# EAGLE design Z80_Busses (EAGLE 5.10)
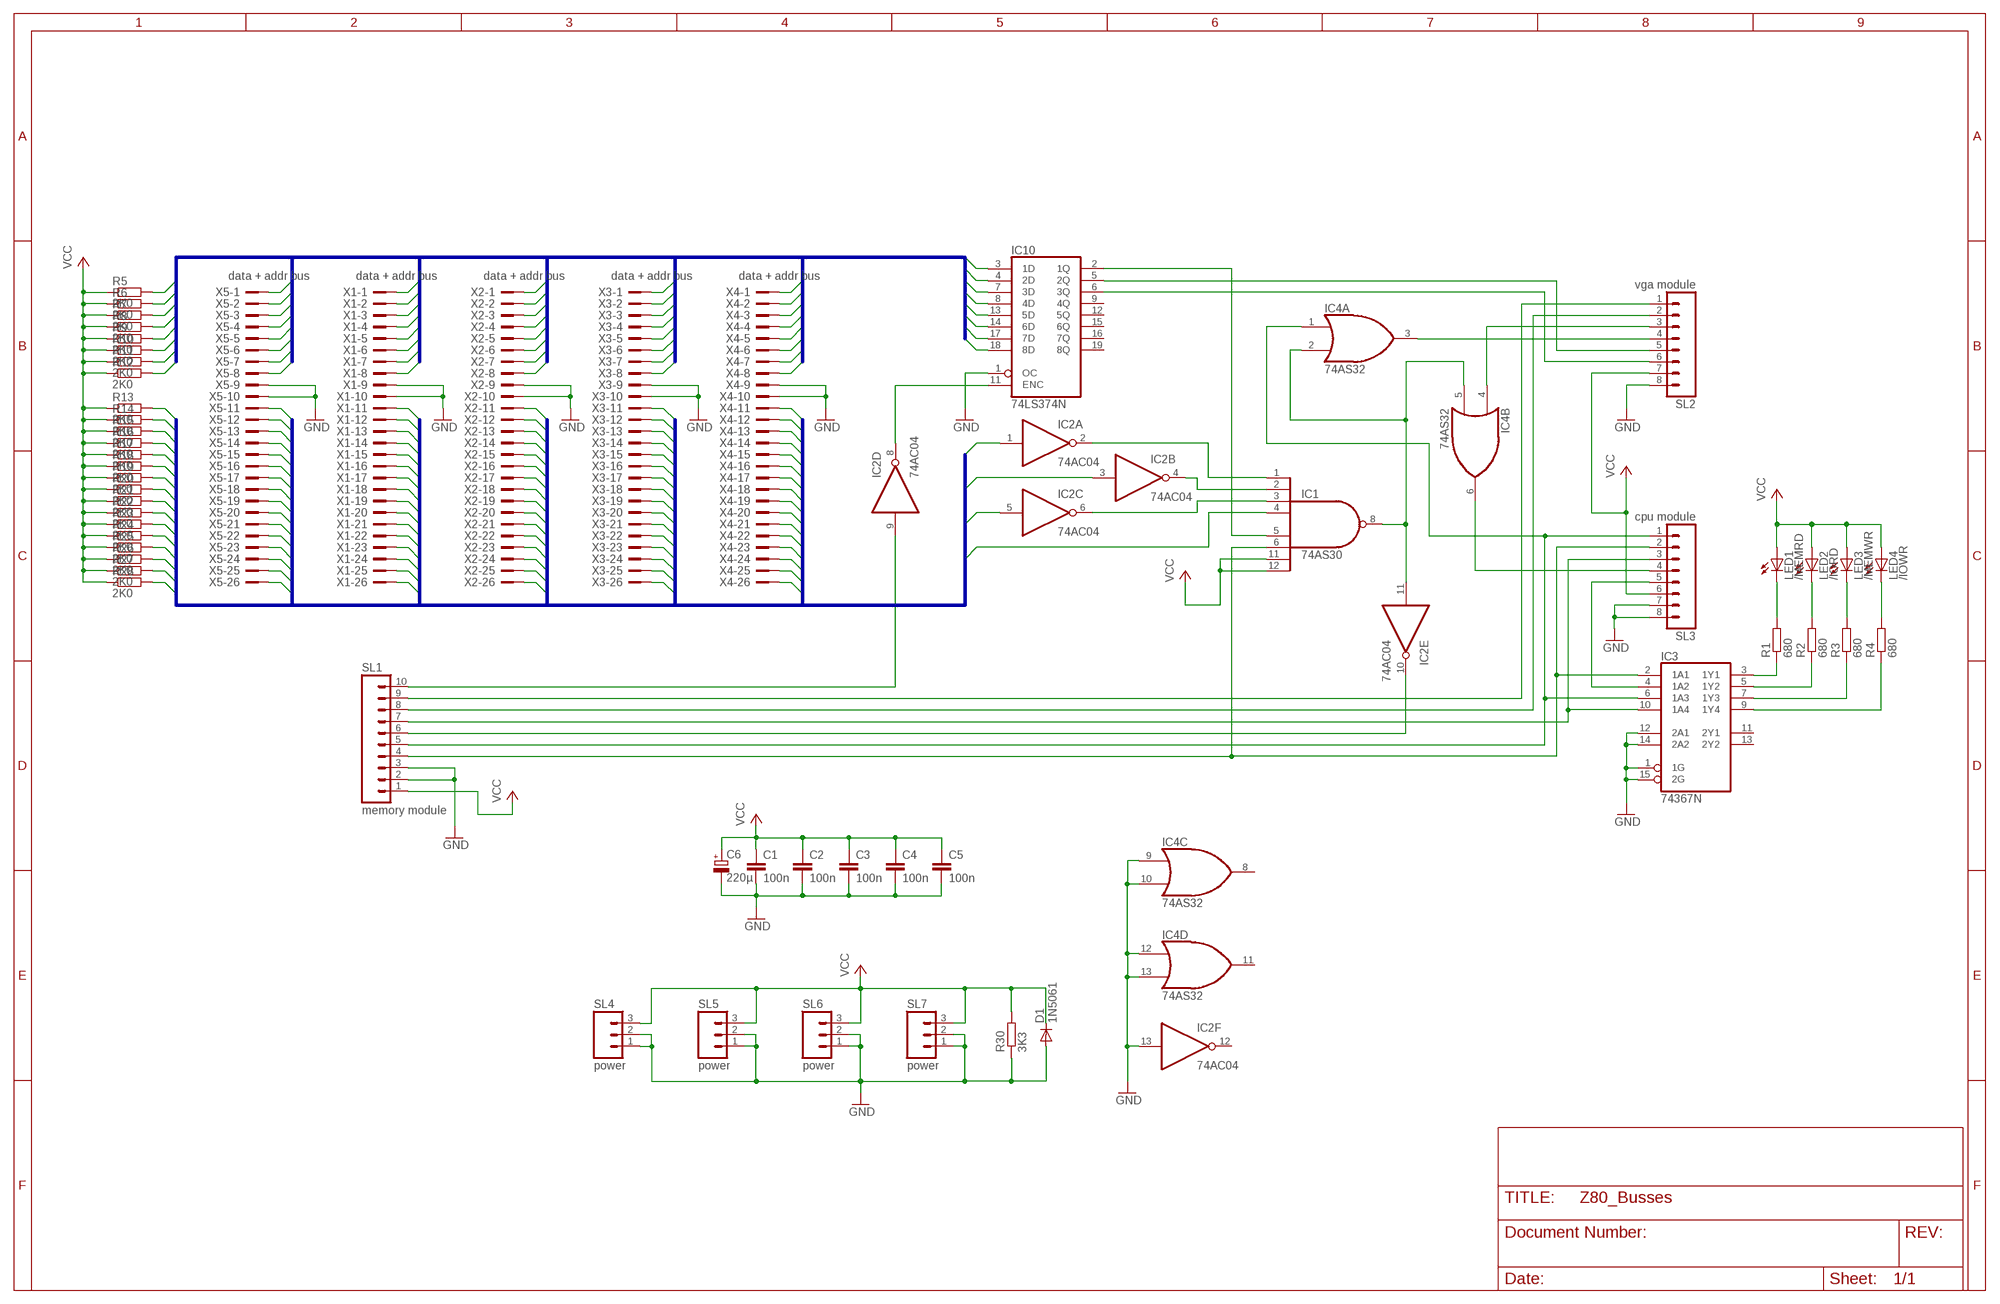
[diagram p0: schematic, sheet 1]

## Parts
C1  100n  C-EU050-030X075  [C050-030X075]
C2  100n  C-EU050-030X075  [C050-030X075]
C3  100n  C-EU050-030X075  [C050-030X075]
C4  100n  C-EU050-030X075  [C050-030X075]
C5  100n  C-EU050-030X075  [C050-030X075]
C6  220µ  CPOL-EUE3.5-10  [E3,5-10]
D1  1N5061  [SOD57-10]
IC1  74AS30  7430N  [DIL14]
IC2  74AC04  7404N  [DIL14]
IC3  74367N  [DIL16]
IC4  74AS32  7432N  [DIL14]
IC10  74LS374N  74LS373N  [DIL20]
LED1  /MEMRD  LED5MM  [LED5MM]
LED2  /IORD  LED5MM  [LED5MM]
LED3  /MEMWR  LED5MM  [LED5MM]
LED4  /IOWR  LED5MM  [LED5MM]
R1  680  R-EU_0207/10  [0207/10]
R2  680  R-EU_0207/10  [0207/10]
R3  680  R-EU_0207/10  [0207/10]
R4  680  R-EU_0207/10  [0207/10]
R5  2K0  R-EU_0204/2V  [0204V]
R6  2K0  R-EU_0204/2V  [0204V]
R7  2K0  R-EU_0204/2V  [0204V]
R8  2K0  R-EU_0204/2V  [0204V]
R9  2K0  R-EU_0204/2V  [0204V]
R10  2K0  R-EU_0204/2V  [0204V]
R11  2K0  R-EU_0204/2V  [0204V]
R12  2K0  R-EU_0204/2V  [0204V]
R13  2K0  R-EU_0204/2V  [0204V]
R14  2K0  R-EU_0204/2V  [0204V]
R15  2K0  R-EU_0204/2V  [0204V]
R16  2K0  R-EU_0204/2V  [0204V]
R17  2K0  R-EU_0204/2V  [0204V]
R18  2K0  R-EU_0204/2V  [0204V]
R19  2K0  R-EU_0204/2V  [0204V]
R20  2K0  R-EU_0204/2V  [0204V]
R21  2K0  R-EU_0204/2V  [0204V]
R22  2K0  R-EU_0204/2V  [0204V]
R23  2K0  R-EU_0204/2V  [0204V]
R24  2K0  R-EU_0204/2V  [0204V]
R25  2K0  R-EU_0204/2V  [0204V]
R26  2K0  R-EU_0204/2V  [0204V]
R27  2K0  R-EU_0204/2V  [0204V]
R28  2K0  R-EU_0204/2V  [0204V]
R30  3K3  R-EU_0207/10  [0207/10]
SL1  memory module  M10  [10P]
SL2  vga module  M08  [08P]
SL3  cpu module  M08  [08P]
SL4  power  M03  [03P]
SL5  power  M03  [03P]
SL6  power  M03  [03P]
SL7  power  M03  [03P]
X1  data + addr bus  2526-  [PAK100/2500-26]
X2  data + addr bus  2526-  [PAK100/2500-26]
X3  data + addr bus  2526-  [PAK100/2500-26]
X4  data + addr bus  2526-  [PAK100/2500-26]
X5  data + addr bus  2526-  [PAK100/2500-26]

## Nets
/A13: IC1.3(I2) IC2.6(C:O)
/A14: IC1.2(I1) IC2.4(B:O)
/A15: IC1.1(I0) IC2.2(A:O)
/EN_RAM0: IC2.10(E:O) SL1.6
/IORD: IC3.4(1A2) SL3.5
/IORD_B: IC3.5(1Y2) R2.1
/IOWR: IC3.10(1A4) SL1.7 SL3.3
/IOWR_B: IC3.9(1Y4) R4.1
/MEMRD: IC1.6(I5) IC3.2(1A1) SL1.4 SL3.2
/MEMRD_B: IC3.3(1Y1) R1.1
/MEMWR: IC3.6(1A3) IC4.1(A:I0) SL1.5 SL3.1
/MEMWR_B: IC3.7(1Y3) R3.1
/VRAM_ACCESS: IC1.8(O) IC2.11(E:I) IC4.2(A:I1) IC4.5(B:I1)
/VRAM_BUSY: IC4.4(B:I0) SL2.3
/WAIT0: IC4.6(B:O) SL3.4
/WR_PORT5: SL1.8 SL2.2
/WR_PORT6: SL1.9 SL2.1
/WR_PORT7: IC2.9(D:I) SL1.10
/WR_VRAM: IC4.3(A:O) SL2.4
A0: R13.2 X1.11 X2.11 X3.11 X4.11 X5.11
A1: R14.2 X1.12 X2.12 X3.12 X4.12 X5.12
A2: R15.2 X1.13 X2.13 X3.13 X4.13 X5.13
A3: R16.2 X1.14 X2.14 X3.14 X4.14 X5.14
A4: R17.2 X1.15 X2.15 X3.15 X4.15 X5.15
A5: R18.2 X1.16 X2.16 X3.16 X4.16 X5.16
A6: R19.2 X1.17 X2.17 X3.17 X4.17 X5.17
A7: R20.2 X1.18 X2.18 X3.18 X4.18 X5.18
A8: R21.2 X1.19 X2.19 X3.19 X4.19 X5.19
A9: R22.2 X1.20 X2.20 X3.20 X4.20 X5.20
A10: R23.2 X1.21 X2.21 X3.21 X4.21 X5.21
A11: R24.2 X1.22 X2.22 X3.22 X4.22 X5.22
A12: IC1.4(I3) R25.2 X1.23 X2.23 X3.23 X4.23 X5.23
A13: IC2.5(C:I) R26.2 X1.24 X2.24 X3.24 X4.24 X5.24
A14: IC2.3(B:I) R27.2 X1.25 X2.25 X3.25 X4.25 X5.25
A15: IC2.1(A:I) R28.2 X1.26 X2.26 X3.26 X4.26 X5.26
D0: IC10.3(1D) R5.2 X1.1 X2.1 X3.1 X4.1 X5.1
D1: IC10.4(2D) R6.2 X1.2 X2.2 X3.2 X4.2 X5.2
D2: IC10.7(3D) R7.2 X1.3 X2.3 X3.3 X4.3 X5.3
D3: IC10.8(4D) R8.2 X1.4 X2.4 X3.4 X4.4 X5.4
D4: IC10.13(5D) R9.2 X1.5 X2.5 X3.5 X4.5 X5.5
D5: IC10.14(6D) R10.2 X1.6 X2.6 X3.6 X4.6 X5.6
D6: IC10.17(7D) R11.2 X1.7 X2.7 X3.7 X4.7 X5.7
D7: IC10.18(8D) R12.2 X1.8 X2.8 X3.8 X4.8 X5.8
GND: C1.2 C2.2 C3.2 C4.2 C5.2 C6.- D1.A IC2.13(F:I) IC3.1(1G) IC3.12(2A1) IC3.14(2A2) IC3.15(2G) IC4.9(C:I0) IC4.10(C:I1) IC4.12(D:I0) IC4.13(D:I1) IC10.1(OC) R30.1 SL1.2 SL1.3 SL2.8 SL3.7 SL3.8 SL4.1 SL4.2 SL5.1 SL5.2 SL6.1 SL6.2 SL7.1 SL7.2 X1.9 X1.10 X2.9 X2.10 X3.9 X3.10 X4.9 X4.10 X5.9 X5.10
N$1: LED1.K(C) R1.2
N$2: LED2.K(C) R2.2
N$3: LED3.K(C) R3.2
N$4: LED4.K(C) R4.2
P_VRAM0: IC1.5(I4) IC10.2(1Q)
P_VRAM1: IC10.5(2Q) SL2.5
P_VRAM2: IC10.6(3Q) SL2.6
VCC: C1.1 C2.1 C3.1 C4.1 C5.1 C6.+ D1.C IC1.11(I6) IC1.12(I7) LED1.A LED2.A LED3.A LED4.A R5.1 R6.1 R7.1 R8.1 R9.1 R10.1 R11.1 R12.1 R13.1 R14.1 R15.1 R16.1 R17.1 R18.1 R19.1 R20.1 R21.1 R22.1 R23.1 R24.1 R25.1 R26.1 R27.1 R28.1 R30.2 SL1.1 SL2.7 SL3.6 SL4.3 SL5.3 SL6.3 SL7.3
WR_PORT7: IC2.8(D:O) IC10.11(ENC)
Unconnected: IC2.12(F:O) IC3.11(2Y1) IC3.13(2Y2) IC4.8(C:O) IC4.11(D:O) IC10.9(4Q) IC10.12(5Q) IC10.15(6Q) IC10.16(7Q) IC10.19(8Q)

## Buses
A[0..15]
D[0..8]

## Power pins joined to a net without a drawn wire
GND: IC1.7(GND) IC2.7(P:GND) IC3.8(GND) IC4.7(P:GND) IC10.10(GND)
VCC: IC1.14(VCC) IC2.14(P:VCC) IC3.16(VCC) IC4.14(P:VCC) IC10.20(VCC)

## Library data of the parts
C1-C5 = rcl:C-EU: CAPACITOR, European symbol
C6 = rcl:CPOL-EU: POLARIZED CAPACITOR, European symbol
D1 = diode:1N5061: DIODE controlled avalanche rectifier
IC1 = 74xx-us:74*30: 8-input NAND gate
IC2 = 74xx-us:74*04: Hex INVERTER
IC3 = 74xx-us:74*367: Hex BUS DRIVER, 3-state
IC4 = 74xx-us:74*32: Quad 2-input OR gate
IC10 = 74xx-us:74*373: Octal D type transparent LATCH, edge triggered
LED1-LED4 = led:LED: LED OSRAM: - CHIPLED LG R971, LG N971, LY N971, LG Q971, LY Q971, LO R971, LY R971 LH N974, LH R974 LS Q976, LO Q976, LY Q976 LO Q996 - Hyper CHIPLED LW Q18S LB Q993, LB Q99A, LB R99A - SideLED LS A670, LO A670, LY A670, LG A670, LP A670 LB A673, LV A673, LT A673, LW A673 LH A674 LY A675 LS A676, LA A676, LO A676, LY A676, LW A676 LS A679, LY A679, LG A679 - Hyper Micro SIDELED® LS Y876, LA Y876, LO Y876, LY Y876 LT Y87S - SmartLED LW L88C, LW L88S LB L89C, LB L89S, LG L890 LS L89K, LO L89K, LY L89K LS L896, LA L896, LO L896, LY L896 - TOPLED LS T670, LO T670, LY T670, LG T670, LP T670 LSG T670, LSP T670, LSY T670, LOP T670, LYG T670 LG T671, LOG T671, LSG T671 LB T673, LV T673, LT T673, LW T673 LH T674 LS T676, LA T676, LO T676, LY T676, LB T676, LH T676, LSB T676, LW T676 LB T67C, LV T67C, LT T67C, LS T67K, LO T67K, LY T67K, LW E67C LS E67B, LA E67B, LO E67B, LY E67B, LB E67C, LV E67C, LT E67C LW T67C LS T679, LY T679, LG T679 LS T770, LO T770, LY T770, LG T770, LP T770 LB T773, LV T773, LT T773, LW T773 LH T774 LS E675, LA E675, LY E675, LS T675 LS T776, LA T776, LO T776, LY T776, LB T776 LHGB T686 LT T68C, LB T68C - Hyper Mini TOPLED® LB M676 - Mini TOPLED Santana® LG M470 LS M47K, LO M47K, LY M47K Source: http://www.osram.convergy.de LUXEON: - LUMILED® LXK2-PW12-R00, LXK2-PW12-S00, LXK2-PW14-U00, LXK2-PW14-V00 LXK2-PM12-R00, LXK2-PM12-S00, LXK2-PM14-U00 LXK2-PE12-Q00, LXK2-PE12-R00, LXK2-PE12-S00, LXK2-PE14-T00, LXK2-PE14-U00 LXK2-PB12-K00, LXK2-PB12-L00, LXK2-PB12-M00, LXK2-PB14-N00, LXK2-PB14-P00, LXK2-PB14-Q00 LXK2-PR12-L00, LXK2-PR12-M00, LXK2-PR14-Q00, LXK2-PR14-R00 LXK2-PD12-Q00, LXK2-PD12-R00, LXK2-PD12-S00 LXK2-PH12-R00, LXK2-PH12-S00 LXK2-PL12-P00, LXK2-PL12-Q00, LXK2-PL12-R00 Source: www.luxeon.com KINGBRIGHT: KA-3528ASYC Source: www.kingbright.com
R1-R28 R30 = rcl:R-EU_: RESISTOR, European symbol
SL1 = con-amp-quick:M10: AMP QUICK CONNECTOR
SL2 SL3 = con-amp-quick:M08: AMP QUICK CONNECTOR
SL4-SL7 = con-amp-quick:M03: AMP QUICK CONNECTOR
X1-X5 = con-3m:2526-: 3M (TM) Pak 100 4-Wall Header Source: 3M

## Board
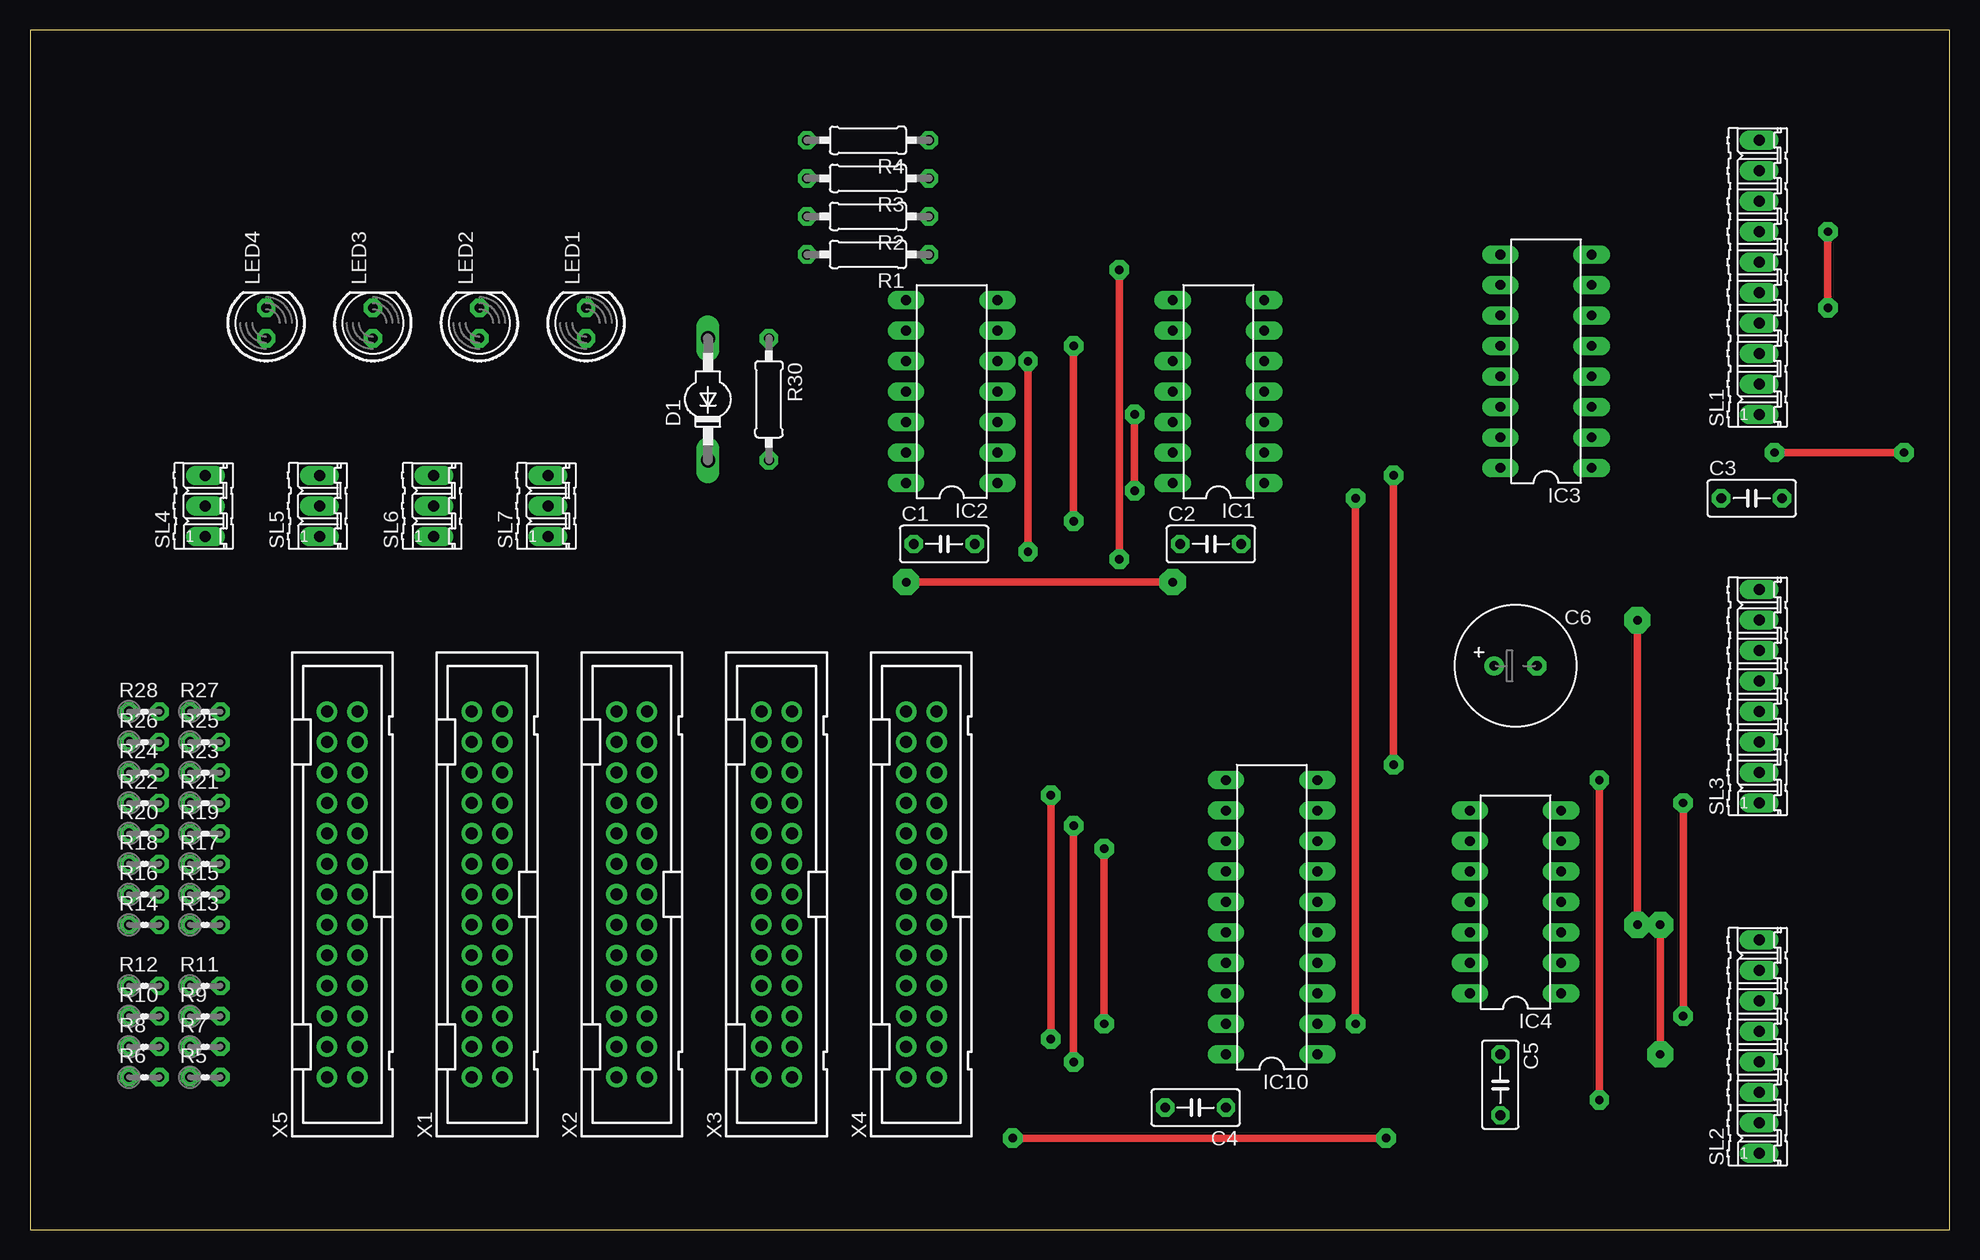
[diagram p1: board, top side]
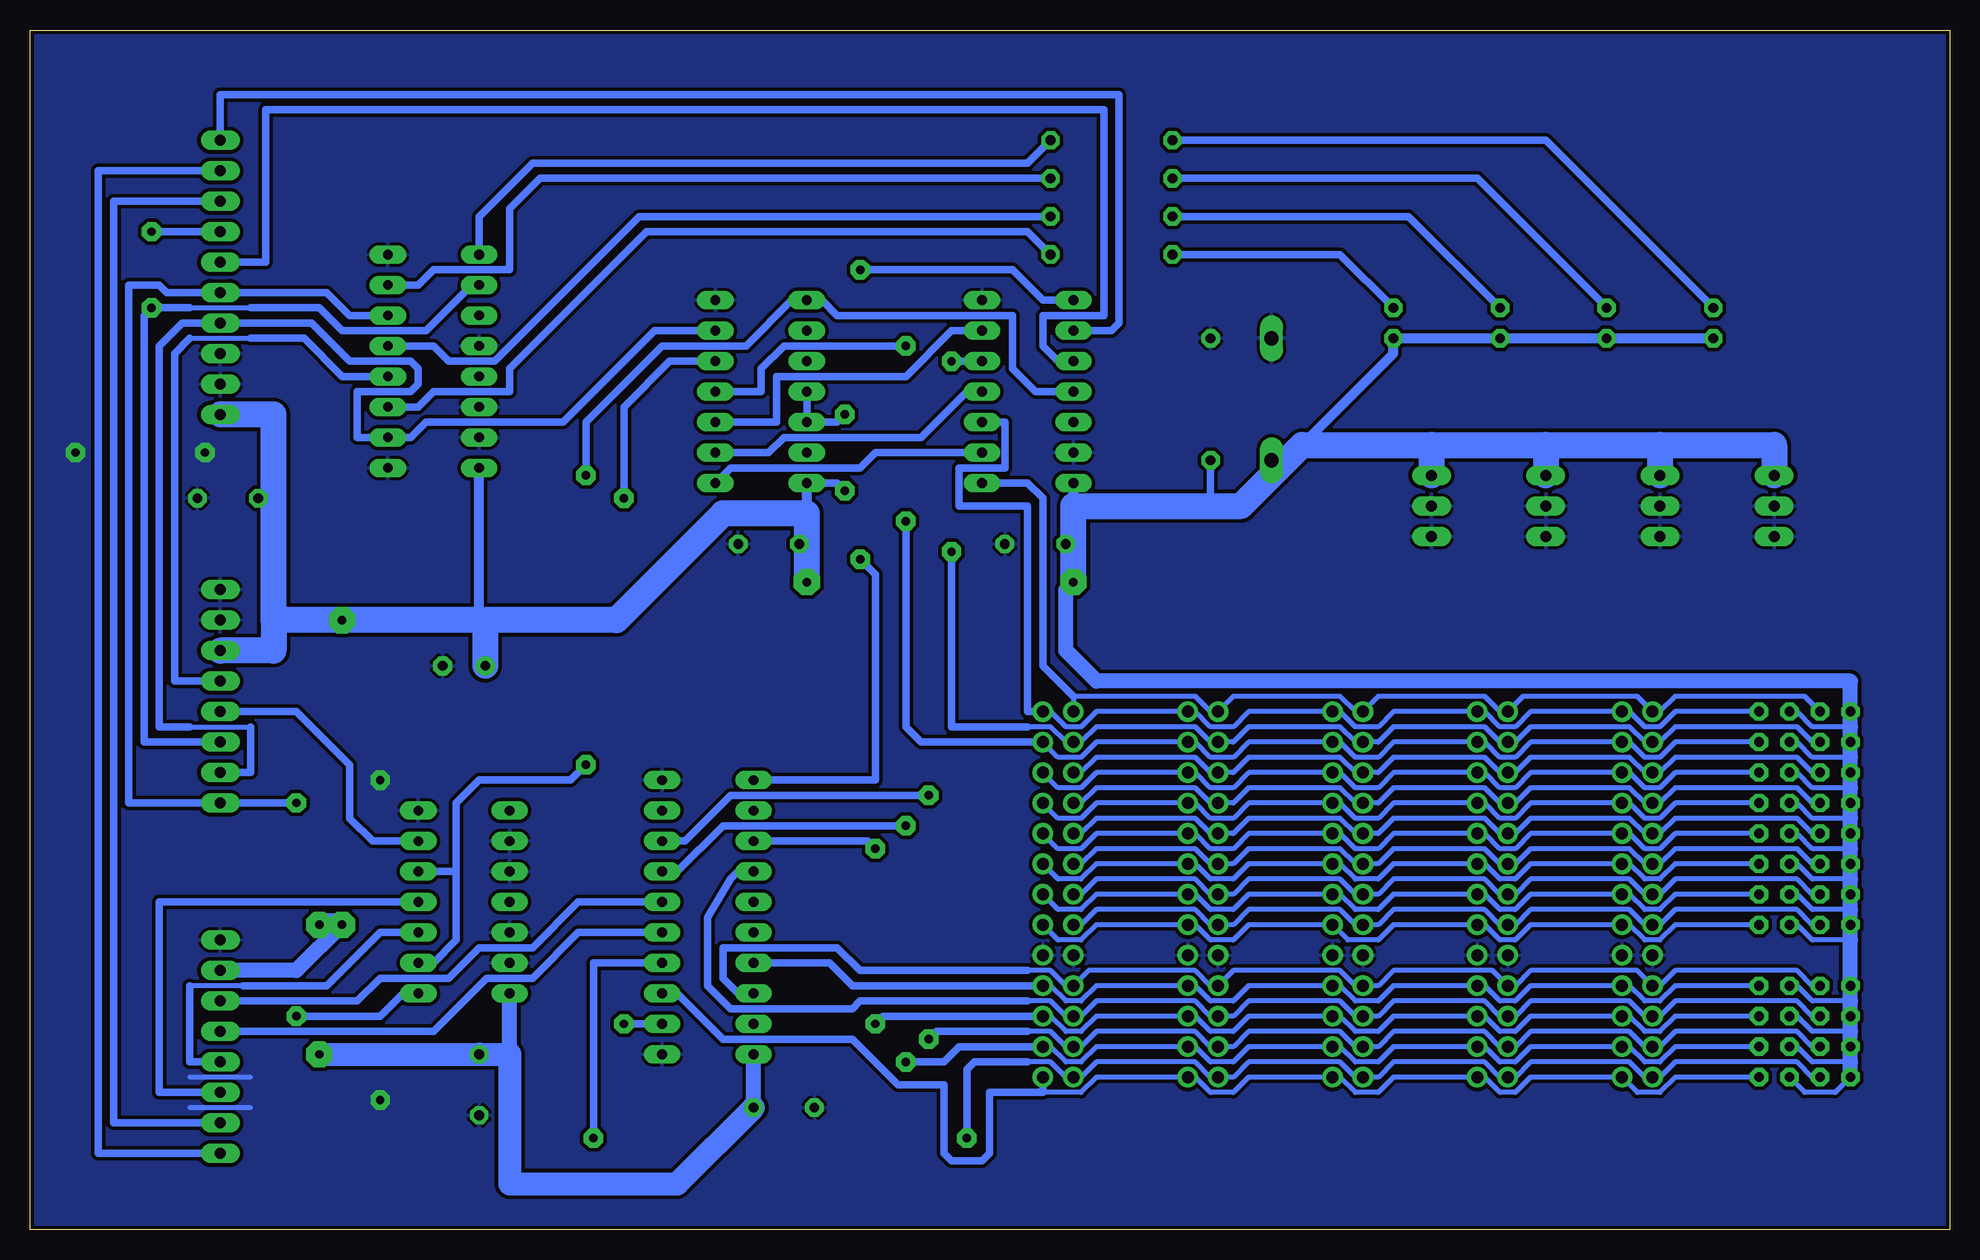
[diagram p2: board, bottom side, seen from below]

Size 160 x 100 mm. Coordinates in mm from the lower left corner, seen from the top.
Outline: 0,0 160,0 160,100 0,100 0,0
Copper layers (1*16): Top 0.035mm / dielectric 1.5mm / Bottom 0.035mm
Design rules "default *": minimum track width 16mil, minimum drill 24mil, track to track 12mil, track to pad 12mil, pad to pad 8mil, via to via 8mil, smd to smd 8mil, copper to edge 12mil, drill to drill 8mil, minimum pad ring 14mil, minimum via ring 18mil, stop-mask expansion 4mil, vias tented up to drill 0mil, thermal gap 10mil

### Footprints (pad centres in the part's own frame; a part is rotated, then mirrored left to right if it is on the bottom)
C050-030X075 = drill 0.813 octagon: 1 -2.54,0; 2 2.54,0
E3,5-10 = drill 0.813 pad 1.6 round: + -1.778,0 | drill 0.813 pad 1.6 octagon: - 1.778,0
SOD57-10 = drill 1.194 long: A 5.08,0; C -5.08,0
DIL14 = drill 0.813 long: 1 -7.62,-3.81; 2 -5.08,-3.81; 3 -2.54,-3.81; 4 0,-3.81; 5 2.54,-3.81; 6 5.08,-3.81; 7 7.62,-3.81; 8 7.62,3.81; 9 5.08,3.81; 10 2.54,3.81; 11 0,3.81; 12 -2.54,3.81; 13 -5.08,3.81; 14 -7.62,3.81
DIL16 = drill 0.813 long: 1 -8.89,-3.81; 2 -6.35,-3.81; 3 -3.81,-3.81; 4 -1.27,-3.81; 5 1.27,-3.81; 6 3.81,-3.81; 7 6.35,-3.81; 8 8.89,-3.81; 9 8.89,3.81; 10 6.35,3.81; 11 3.81,3.81; 12 1.27,3.81; 13 -1.27,3.81; 14 -3.81,3.81; 15 -6.35,3.81; 16 -8.89,3.81
DIL20 = drill 0.813 long: 1 -11.43,-3.81; 2 -8.89,-3.81; 3 -6.35,-3.81; 4 -3.81,-3.81; 5 -1.27,-3.81; 6 1.27,-3.81; 7 3.81,-3.81; 8 6.35,-3.81; 9 8.89,-3.81; 10 11.43,-3.81; 11 11.43,3.81; 12 8.89,3.81; 13 6.35,3.81; 14 3.81,3.81; 15 1.27,3.81; 16 -1.27,3.81; 17 -3.81,3.81; 18 -6.35,3.81; 19 -8.89,3.81; 20 -11.43,3.81
LED5MM = drill 0.813 octagon: A -1.27,0; K 1.27,0
0207/10 = drill 0.813 octagon: 1 -5.08,0; 2 5.08,0
0204V = drill 0.813 octagon: 1 -1.27,0; 2 1.27,0
10P = drill 0.914 long: 1 -11.43,0; 2 -8.89,0; 3 -6.35,0; 4 -3.81,0; 5 -1.27,0; 6 1.27,0; 7 3.81,0; 8 6.35,0; 9 8.89,0; 10 11.43,0
08P = drill 0.914 long: 1 -8.89,0; 2 -6.35,0; 3 -3.81,0; 4 -1.27,0; 5 1.27,0; 6 3.81,0; 7 6.35,0; 8 8.89,0
03P = drill 0.914 long: 1 -2.54,0; 2 0,0; 3 2.54,0
PAK100/2500-26 = drill 1 pad 1.422 round: 1 -15.24,-1.27; 2 -15.24,1.27; 3 -12.7,-1.27; 4 -12.7,1.27; 5 -10.16,-1.27; 6 -10.16,1.27; 7 -7.62,-1.27; 8 -7.62,1.27; 9 -5.08,-1.27; 10 -5.08,1.27; 11 -2.54,-1.27; 12 -2.54,1.27; 13 0,-1.27; 14 0,1.27; 15 2.54,-1.27; 16 2.54,1.27; 17 5.08,-1.27; 18 5.08,1.27; 19 7.62,-1.27; 20 7.62,1.27; 21 10.16,-1.27; 22 10.16,1.27; 23 12.7,-1.27; 24 12.7,1.27; 25 15.24,-1.27; 26 15.24,1.27

### Placement (x,y rotation side)
C1  76.2,57.15 0 top
C2  98.42,57.15 0 top
C3  143.51,60.96 0 top
C4  97.16,10.16 180 top
C5  122.56,12.06 270 top
C6  123.83,46.99 0 top
D1  56.52,69.22 90 top
IC1  99.06,69.85 90 top
IC2  76.83,69.85 90 top
IC3  126.36,72.39 90 top
IC4  123.83,27.3 90 top
IC10  103.5,26.04 90 top
LED1  46.35,75.56 90 top
LED2  37.47,75.56 90 top
LED3  28.57,75.56 90 top
LED4  19.68,75.56 90 top
R1  69.85,81.28 180 top
R2  69.85,84.45 180 top
R3  69.85,87.63 180 top
R4  69.85,90.81 180 top
R5  14.61,12.7 0 top
R6  9.53,12.7 0 top
R7  14.61,15.24 0 top
R8  9.53,15.24 0 top
R9  14.61,17.78 0 top
R10  9.53,17.78 0 top
R11  14.61,20.32 0 top
R12  9.53,20.32 0 top
R13  14.61,25.4 0 top
R14  9.53,25.4 0 top
R15  14.61,27.94 0 top
R16  9.53,27.94 0 top
R17  14.61,30.48 0 top
R18  9.53,30.48 0 top
R19  14.61,33.02 0 top
R20  9.53,33.02 0 top
R21  14.61,35.56 0 top
R22  9.53,35.56 0 top
R23  14.61,38.1 0 top
R24  9.53,38.1 0 top
R25  14.61,40.64 0 top
R26  9.53,40.64 0 top
R27  14.61,43.18 0 top
R28  9.53,43.18 0 top
R30  61.59,69.22 270 top
SL1  144.15,79.38 90 top
SL2  144.15,15.24 90 top
SL3  144.15,44.45 90 top
SL4  14.61,60.33 90 top
SL5  24.13,60.33 90 top
SL6  33.66,60.33 90 top
SL7  43.18,60.33 90 top
X1  38.1,27.94 90 top
X2  50.16,27.94 90 top
X3  62.23,27.94 90 top
X4  74.3,27.94 90 top
X5  26.04,27.94 90 top

### Tracks (layer width: path | path; a pad name or v marks a point on that pad's centre or on a via)
/A13
  Bottom 0.61: IC1.3 97.79,67.31 97.79,71.12 87,71.12 83.19,74.93 IC2.6
/A14
  Bottom 0.61: IC2.4 81.92,69.85 85.72,66.04 97.16,66.04 98.42,64.77 IC1.2
/A15
  Bottom 0.61: IC2.2 89.53,64.77 90.81,63.5 101.6,63.5 IC1.1
/EN_RAM0
  Bottom 0.61: IC2.10 74.3,72.39 75.56,73.66 75.56,76.2 70.48,76.2 70.48,93.34 140.34,93.34 140.34,80.64 SL1.6
/IORD
  Bottom 0.406: 146.69,74.3 141.6,74.3
  Bottom 0.61: IC3.4 133.99,71.12 137.16,74.3 141.6,74.3 | 146.69,74.3 147.96,73.03 147.96,45.72 SL3.5
/IORD_B
  Bottom 0.61: R2.1 109.22,84.45 121.28,72.39 125.09,72.39 126.36,73.66 IC3.5
/IOWR  (via drill 0.7)
  Top 0.61: v149.86,76.83 v149.86,83.19
  Bottom 0.406: 146.69,76.83 141.6,76.83
  Bottom 0.61: SL3.3 150.5,40.64 150.5,76.2 v149.86,76.83 146.69,76.83 | v149.86,83.19 SL1.7 | IC3.10 123.19,78.74 127,74.93 133.99,74.93 135.89,76.83 141.6,76.83
/IOWR_B
  Bottom 0.61: R4.1 76.83,88.9 118.11,88.9 122.56,84.45 IC3.9
/MEMRD
  Bottom 0.406: 146.69,41.91 141.6,41.91
  Bottom 0.61: 146.69,41.91 149.22,41.91 149.22,73.66 147.32,75.56 SL1.4 136.53,75.56 133.35,72.39 128.27,72.39 127.64,71.75 127.64,70.48 128.27,69.85 132.72,69.85 132.72,66.04 IC3.2 128.27,66.04 127,67.31 115.57,67.31 107.95,74.93 IC1.6 | 141.6,41.91 141.6,38.1 SL3.2
/MEMRD_B
  Bottom 0.61: IC3.3 127.64,68.58 126.36,69.85 120.02,69.85 120.02,71.75 108.58,83.19 76.83,83.19 R1.1
/MEMWR  (via drill 0.7)
  Top 0.61: v137.79,17.78 v137.79,35.56
  Bottom 0.61: IC4.1 128.91,19.68 130.81,17.78 v137.79,17.78 | v137.79,35.56 SL3.1 151.76,35.56 151.76,76.2 151.76,78.74 149.22,78.74 148.59,78.11 SL1.5 135.25,78.11 133.35,76.2 IC3.6
/MEMWR_B
  Bottom 0.61: IC3.7 127.64,78.74 126.36,80.01 120.02,80.01 120.02,85.09 117.47,87.63 R3.1
/VRAM_ACCESS  (via drill 0.7 pad 1.27)
  Top 0.61: v113.67,62.87 v113.67,38.73
  Bottom 0.61: IC2.11 76.2,69.85 78.11,71.75 78.11,76.2 92.71,76.2 93.98,77.47 IC1.8 96.52,77.47 100.33,73.66 107.31,73.66 113.67,67.31 v113.67,62.87 | IC4.2 126.36,22.23 124.46,24.13 124.46,29.84 | 124.46,29.84 IC4.5 | 124.46,29.84 124.46,35.56 122.56,37.47 114.94,37.47 v113.67,38.73
/VRAM_BUSY
  Bottom 0.61: IC4.4 149.22,27.3 149.22,11.43 SL2.3
/WAIT0
  Bottom 0.61: IC4.6 131.44,32.38 133.35,34.29 133.35,38.73 137.79,43.18 SL3.4
/WR_PORT5
  Bottom 0.61: SL1.8 153.03,85.72 153.03,8.89 SL2.2
/WR_PORT6
  Bottom 0.61: SL1.9 154.31,88.27 154.31,6.35 SL2.1
/WR_PORT7
  Bottom 0.61: IC2.9 69.85,74.93 69.22,75.56 69.22,94.61 144.15,94.61 SL1.10
/WR_VRAM
  Bottom 0.406: 142.24,20.32 146.69,20.32
  Bottom 0.61: IC4.3 130.81,24.77 135.25,20.32 142.24,20.32 | 146.69,20.32 146.69,13.97 SL2.4
A0
  Bottom 0.406: X4.11 74.3,24.13 72.39,24.13 71.12,25.4 X3.11 62.87,25.4 61.59,24.13 59.69,24.13 58.42,25.4 X2.11 50.16,24.13 47.62,24.13 46.35,25.4 X1.11 38.73,25.4 37.47,24.13 36.2,24.13 34.92,25.4 X5.11 26.67,25.4 25.4,24.13 24.13,24.13 22.86,25.4 R13.2
A1
  Bottom 0.406: X4.12 72.39,25.4 71.12,26.67 62.87,26.67 61.59,25.4 X3.12 59.69,25.4 58.42,26.67 50.8,26.67 49.53,25.4 X2.12 47.62,25.4 46.35,26.67 38.73,26.67 37.47,25.4 X1.12 36.2,25.4 34.92,26.67 26.67,26.67 25.4,25.4 X5.12 24.13,25.4 22.86,26.67 12.7,26.67 11.43,25.4 R14.2
A2
  Bottom 0.406: X4.13 74.3,26.67 72.39,26.67 71.12,27.94 X3.13 62.87,27.94 61.59,26.67 59.69,26.67 58.42,27.94 X2.13 50.8,27.94 49.53,26.67 47.62,26.67 46.35,27.94 X1.13 38.73,27.94 37.47,26.67 36.2,26.67 34.92,27.94 X5.13 26.67,27.94 25.4,26.67 24.13,26.67 22.86,27.94 R15.2
A3
  Bottom 0.406: X4.14 72.39,27.94 71.12,29.21 62.87,29.21 61.59,27.94 X3.14 59.69,27.94 58.42,29.21 50.8,29.21 49.53,27.94 X2.14 47.62,27.94 46.35,29.21 38.73,29.21 37.47,27.94 X1.14 36.2,27.94 34.92,29.21 26.67,29.21 25.4,27.94 X5.14 24.13,27.94 22.86,29.21 12.7,29.21 11.43,27.94 R16.2
A4
  Bottom 0.406: R17.2 22.86,30.48 24.13,29.21 25.4,29.21 26.67,30.48 X5.15 34.92,30.48 36.2,29.21 37.47,29.21 38.73,30.48 X1.15 46.35,30.48 47.62,29.21 49.53,29.21 50.8,30.48 X2.15 58.42,30.48 59.69,29.21 61.59,29.21 62.87,30.48 X3.15 71.12,30.48 72.39,29.21 74.3,29.21 X4.15
A5
  Bottom 0.406: X4.16 72.39,30.48 71.12,31.75 62.87,31.75 61.59,30.48 X3.16 59.69,30.48 58.42,31.75 50.8,31.75 49.53,30.48 X2.16 47.62,30.48 46.35,31.75 38.73,31.75 37.47,30.48 X1.16 36.2,30.48 34.92,31.75 26.67,31.75 25.4,30.48 X5.16 24.13,30.48 22.86,31.75 12.7,31.75 11.43,30.48 R18.2
A6
  Bottom 0.406: R19.2 22.86,33.02 24.13,31.75 25.4,31.75 26.67,33.02 X5.17 34.92,33.02 36.2,31.75 37.47,31.75 38.73,33.02 X1.17 46.35,33.02 47.62,31.75 49.53,31.75 50.8,33.02 X2.17 58.42,33.02 59.69,31.75 61.59,31.75 62.87,33.02 X3.17 71.12,33.02 72.39,31.75 74.3,31.75 X4.17
A7
  Bottom 0.406: X4.18 72.39,33.02 71.12,34.29 62.87,34.29 61.59,33.02 X3.18 59.69,33.02 58.42,34.29 50.8,34.29 49.53,33.02 X2.18 47.62,33.02 46.35,34.29 38.73,34.29 37.47,33.02 X1.18 36.2,33.02 34.92,34.29 26.67,34.29 25.4,33.02 X5.18 24.13,33.02 22.86,34.29 12.7,34.29 11.43,33.02 R20.2
A8
  Bottom 0.406: R21.2 22.86,35.56 24.13,34.29 25.4,34.29 26.67,35.56 X5.19 34.92,35.56 36.2,34.29 37.47,34.29 38.73,35.56 X1.19 46.35,35.56 47.62,34.29 49.53,34.29 50.8,35.56 X2.19 58.42,35.56 59.69,34.29 61.59,34.29 62.87,35.56 X3.19 71.12,35.56 72.39,34.29 74.3,34.29 X4.19
A9
  Bottom 0.406: X4.20 72.39,35.56 71.12,36.83 62.87,36.83 61.59,35.56 X3.20 59.69,35.56 58.42,36.83 50.8,36.83 49.53,35.56 X2.20 47.62,35.56 46.35,36.83 38.73,36.83 37.47,35.56 X1.20 36.2,35.56 34.92,36.83 26.67,36.83 25.4,35.56 X5.20 24.13,35.56 22.86,36.83 12.7,36.83 11.43,35.56 R22.2
A10
  Bottom 0.406: R23.2 22.86,38.1 24.13,36.83 25.4,36.83 26.67,38.1 X5.21 34.92,38.1 36.2,36.83 37.47,36.83 38.73,38.1 X1.21 46.35,38.1 47.62,36.83 49.53,36.83 50.8,38.1 X2.21 58.42,38.1 59.69,36.83 61.59,36.83 62.87,38.1 X3.21 71.12,38.1 72.39,36.83 74.3,36.83 X4.21
A11
  Bottom 0.406: X4.22 72.39,38.1 71.12,39.37 62.87,39.37 61.59,38.1 X3.22 59.69,38.1 58.42,39.37 50.8,39.37 49.53,38.1 X2.22 47.62,38.1 46.35,39.37 38.73,39.37 37.47,38.1 X1.22 36.2,38.1 34.92,39.37 26.67,39.37 25.4,38.1 X5.22 24.13,38.1 22.86,39.37 12.7,39.37 11.43,38.1 R24.2
A12  (via drill 0.7)
  Top 0.61: v87,59.05 v87,73.66
  Bottom 0.406: R25.2 22.86,40.64 24.13,39.37 25.4,39.37 26.67,40.64 X5.23 34.92,40.64 36.2,39.37 37.47,39.37 38.73,40.64 X1.23 46.35,40.64 47.62,39.37 49.53,39.37 50.8,40.64 X2.23 58.42,40.64 59.69,39.37 61.59,39.37 62.87,40.64 X3.23 71.12,40.64 72.39,39.37 74.3,39.37 X4.23
  Bottom 0.61: IC1.4 99.06,69.85 99.06,71.75 97.16,73.66 v87,73.66 | v87,59.05 87,41.91 85.72,40.64 X4.23
A13  (via drill 0.7)
  Top 0.61: v83.19,56.52 v83.19,72.39
  Bottom 0.406: 76.83,41.91 74.93,41.91 73.66,40.64 X4.24 72.39,40.64 71.12,41.91 62.87,41.91 61.59,40.64 X3.24 59.69,40.64 58.42,41.91 50.8,41.91 49.53,40.64 X2.24 47.62,40.64 46.35,41.91 38.73,41.91 37.47,40.64 X1.24 36.2,40.64 34.92,41.91 26.67,41.91 25.4,40.64 X5.24 24.13,40.64 22.86,41.91 12.7,41.91 11.43,40.64 R26.2
  Bottom 0.61: 76.83,41.91 83.19,41.91 v83.19,56.52 | v83.19,72.39 IC2.5
A14
  Bottom 0.406: R27.2 22.86,43.18 24.13,41.91 25.4,41.91 26.67,43.18 X5.25 34.92,43.18 36.2,41.91 37.47,41.91 38.73,43.18 X1.25 46.35,43.18 47.62,41.91 49.53,41.91 50.8,43.18 X2.25 58.42,43.18 59.69,41.91 61.59,41.91 62.87,43.18 X3.25 71.12,43.18 72.39,41.91 73.66,41.91 74.93,43.18 X4.25
  Bottom 0.61: X4.25 76.83,43.18 76.83,60.33 82.55,60.33 82.55,63.5 78.74,63.5 78.74,67.31 IC2.3
A15
  Bottom 0.406: X4.26 73.03,44.45 62.87,44.45 61.59,43.18 X3.26 59.69,44.45 50.8,44.45 49.53,43.18 X2.26 47.62,44.45 38.73,44.45 37.47,43.18 X1.26 35.56,44.45 26.04,44.45 X5.26 24.13,43.18 22.86,44.45 12.06,44.45 R28.2
  Bottom 0.61: IC2.1 76.83,62.23 75.56,60.96 75.56,46.99 73.03,44.45
D0
  Bottom 0.406: 75.56,11.43 72.39,11.43 71.12,12.7 X3.1 62.87,12.7 61.59,11.43 59.69,11.43 58.42,12.7 X2.1 50.8,12.7 49.53,11.43 47.62,11.43 46.35,12.7 X1.1 38.73,12.7 37.47,11.43 36.2,11.43 34.92,12.7 X5.1 26.04,11.43 24.13,11.43 22.86,12.7 R5.2
  Bottom 0.61: X4.1 75.56,11.43 80.01,11.43 80.01,6.35 80.64,5.71 83.19,5.71 83.82,6.35 83.82,12.06 87.63,12.06 91.44,15.88 102.23,15.88 106.05,19.68 IC10.3
D1  (via drill 0.7)
  Top 0.61: v81.92,7.62 v113.03,7.62
  Bottom 0.406: 76.83,13.97 74.93,13.97 73.66,12.7 X4.2 72.39,12.7 71.12,13.97 62.87,13.97 61.59,12.7 X3.2 59.69,12.7 58.42,13.97 50.8,13.97 49.53,12.7 X2.2 47.62,12.7 46.35,13.97 38.73,13.97 37.47,12.7 X1.2 36.2,12.7 34.92,13.97 26.67,13.97 25.4,12.7 X5.2 24.13,12.7 22.86,13.97 12.7,13.97 11.43,12.7 R6.2
  Bottom 0.61: v113.03,7.62 113.03,22.23 IC10.4 | v81.92,7.62 81.92,13.34 81.28,13.97 76.83,13.97
D2  (via drill 0.7)
  Top 0.61: v87,13.97 v87,33.66
  Bottom 0.406: X4.3 74.93,15.24 73.66,13.97 72.39,13.97 71.12,15.24 X3.3 62.87,15.24 61.59,13.97 59.69,13.97 58.42,15.24 X2.3 50.8,15.24 49.53,13.97 47.62,13.97 46.35,15.24 X1.3 38.73,15.24 37.47,13.97 36.2,13.97 34.92,15.24 X5.3 26.67,15.24 25.4,13.97 24.13,13.97 22.86,15.24 R7.2
  Bottom 0.61: IC10.7 106.05,29.84 102.23,33.66 v87,33.66 | X4.3 82.55,15.24 83.82,13.97 v87,13.97
D3  (via drill 0.7)
  Top 0.61: v85.09,15.88 v85.09,36.2
  Bottom 0.406: 76.83,16.51 74.93,16.51 73.66,15.24 X4.4 72.39,15.24 71.12,16.51 62.87,16.51 61.59,15.24 X3.4 59.69,15.24 58.42,16.51 50.8,16.51 49.53,15.24 X2.4 47.62,15.24 46.35,16.51 38.73,16.51 37.47,15.24 X1.4 36.2,15.24 34.92,16.51 26.67,16.51 25.4,15.24 X5.4 24.13,15.24 22.86,16.51 12.7,16.51 11.43,15.24 R8.2
  Bottom 0.61: IC10.8 105.41,32.38 101.6,36.2 v85.09,36.2 | 76.83,16.51 84.45,16.51 v85.09,15.88
D4  (via drill 0.7)
  Top 0.61: v89.53,17.14 v89.53,31.75
  Bottom 0.406: X4.5 74.93,17.78 73.66,16.51 72.39,16.51 71.12,17.78 X3.5 62.87,17.78 61.59,16.51 59.69,16.51 58.42,17.78 X2.5 50.8,17.78 49.53,16.51 47.62,16.51 46.35,17.78 X1.5 38.73,17.78 37.47,16.51 36.2,16.51 34.92,17.78 X5.5 26.67,17.78 25.4,16.51 24.13,16.51 22.86,17.78 R9.2
  Bottom 0.61: IC10.13 90.17,32.38 v89.53,31.75 | X4.5 88.9,17.78 v89.53,17.14
D5
  Bottom 0.406: 76.83,19.05 74.93,19.05 73.66,17.78 X4.6 72.39,17.78 71.12,19.05 62.87,19.05 61.59,17.78 X3.6 59.69,17.78 58.42,19.05 50.8,19.05 49.53,17.78 X2.6 47.62,17.78 46.35,19.05 38.73,19.05 37.47,17.78 X1.6 36.2,17.78 34.92,19.05 26.67,19.05 25.4,17.78 X5.6 24.13,17.78 22.86,19.05 12.7,19.05 11.43,17.78 R10.2
  Bottom 0.61: IC10.14 100.97,29.84 101.6,29.21 103.5,26.04 103.5,20.32 101.6,18.41 91.44,18.41 90.81,19.05 76.83,19.05
D6
  Bottom 0.406: X4.7 74.93,20.32 73.66,19.05 72.39,19.05 71.12,20.32 X3.7 62.87,20.32 61.59,19.05 59.69,19.05 58.42,20.32 X2.7 50.8,20.32 49.53,19.05 47.62,19.05 46.35,20.32 X1.7 38.73,20.32 37.47,19.05 36.2,19.05 34.92,20.32 X5.7 26.67,20.32 25.4,19.05 24.13,19.05 22.86,20.32 R11.2
  Bottom 0.61: X4.7 91.44,20.32 93.34,22.23 IC10.17
D7
  Bottom 0.406: 76.83,21.59 74.93,21.59 73.66,20.32 X4.8 71.75,21.59 62.87,21.59 61.59,20.32 X3.8 59.69,21.59 50.8,21.59 49.53,20.32 X2.8 47.62,20.32 46.35,21.59 38.1,21.59 X1.8 36.2,20.32 34.92,21.59 26.04,21.59 X5.8 24.13,20.32 22.86,21.59 12.7,21.59 11.43,20.32 R12.2
  Bottom 0.61: IC10.18 100.97,19.68 102.23,20.95 102.23,23.5 92.71,23.5 90.81,21.59 76.83,21.59
GND  (via drill 0.7)
  Top 0.61: v145.41,64.77 v156.21,64.77 | v130.81,10.79 v130.81,37.47
  Bottom 0.406: 141.6,12.7 146.69,12.7 | 141.6,10.16 146.69,10.16
  pour Bottom: 0,100.33 0,0 160.02,0 160.02,100.33
N$1
  Bottom 0.61: R1.2 50.8,81.28 LED1.K
N$2
  Bottom 0.61: R2.2 45.09,84.45 LED2.K
N$3
  Bottom 0.61: R3.2 39.37,87.63 LED3.K
N$4
  Bottom 0.61: R4.2 33.66,90.81 LED4.K
P_VRAM0  (via drill 0.7)
  Top 0.61: v110.49,17.14 v110.49,60.96
  Bottom 0.61: IC1.5 106.68,72.39 110.49,68.58 v110.49,60.96 | IC10.2 v110.49,17.14
P_VRAM1
  Bottom 0.61: IC10.5 114.3,24.77 118.11,20.95 121.92,20.95 126.36,16.51 SL2.5
P_VRAM2
  Bottom 0.61: SL2.6 132.72,19.05 130.81,20.95 125.09,20.95 122.56,23.5 118.11,23.5 114.3,27.3 IC10.6
VCC  (via drill 0.7, 0.7 pad 2.18)
  Top 0.61: v92.08,61.59 v92.08,67.94 | v135.89,25.4 v135.89,14.61 | v73.03,53.98 v95.25,53.98 | v133.99,50.8 v133.99,25.4
  Bottom 0.406: R27.1 12.7,43.18 11.43,41.91 8.26,41.91 | R13.1 12.7,25.4 11.43,24.13 8.26,24.13 | R15.1 12.7,27.94 11.43,26.67 8.26,26.67 | R17.1 12.7,30.48 11.43,29.21 8.26,29.21 | R19.1 12.7,33.02 11.43,31.75 8.26,31.75 | R21.1 12.7,35.56 11.43,34.29 8.26,34.29 | R23.1 12.7,38.1 11.43,36.83 8.26,36.83 | R25.1 12.7,40.64 11.43,39.37 8.26,39.37 | R11.1 12.7,20.32 11.43,19.05 8.26,19.05 | R9.1 12.7,17.78 11.43,16.51 8.26,16.51 | R7.1 12.7,15.24 11.43,13.97 8.26,13.97 | R5.1 12.06,11.43 9.53,11.43 R6.1
  Bottom 0.61: IC1.11 IC1.12 92.71,67.31 v92.08,67.94 | IC1.14 92.71,62.23 v92.08,61.59 | 61.59,60.33 R30.2 | D1.C 56.2,63.5 56.2,63.18
  Bottom 0.813: 95.25,59.69 IC1.14 | LED4.A LED3.A LED2.A LED1.A 46.35,73.03 53.98,65.41 | 122.56,50.8 IC3.16 | 73.03,60.33 IC2.14
  Bottom 1.27: 95.25,57.78 C2.1 | 73.03,57.78 C1.1 | SL2.7 137.79,21.59 v133.99,25.4 | C4.1 IC10.20 | 120.02,14.61 IC4.14 | 139.7,60.96 C3.1 | R6.1 8.26,13.97 R8.1 8.26,16.51 R10.1 8.26,19.05 R12.1 8.26,24.13 R14.1 8.26,26.67 R16.1 8.26,29.21 R18.1 8.26,31.75 R20.1 8.26,34.29 R22.1 8.26,36.83 R24.1 8.26,39.37 R26.1 8.26,41.91 R28.1 8.26,45.72 71.12,45.72 73.66,48.26 73.66,53.34 v73.03,53.98
  Bottom 1.93: 122.05,50.8 122.56,50.8 | C4.1 106.05,3.81 120.02,3.81 120.02,14.61 C5.1 v135.89,14.61 | v133.99,25.4 v135.89,25.4
  Bottom 2.184: 122.56,50.8 v133.99,50.8 139.7,50.8 | v95.25,53.98 95.25,57.78 95.25,59.69 102.23,59.69 111.12,50.8 122.05,50.8 C6.+ | v73.03,53.98 73.03,57.78 73.03,60.33 61.59,60.33 59.05,60.33 56.2,63.18 53.98,65.41 43.18,65.41 | 139.7,50.8 139.7,60.96 139.7,67.94 SL1.1 | 139.7,50.8 139.7,48.26 SL3.6 | SL4.3 14.61,65.41 24.13,65.41 | 24.13,65.41 SL5.3 | 33.66,65.41 24.13,65.41 | 43.18,65.41 33.66,65.41 | 43.18,65.41 SL7.3 | 33.66,65.41 SL6.3
WR_PORT7  (via drill 0.7)
  Top 0.61: v90.81,55.88 v90.81,80.01
  Bottom 0.61: IC2.8 75.56,77.47 78.11,80.01 v90.81,80.01 | v90.81,55.88 89.53,54.61 89.53,37.47 IC10.11